# EAGLE design RS485-board (EAGLE 9.6.2)
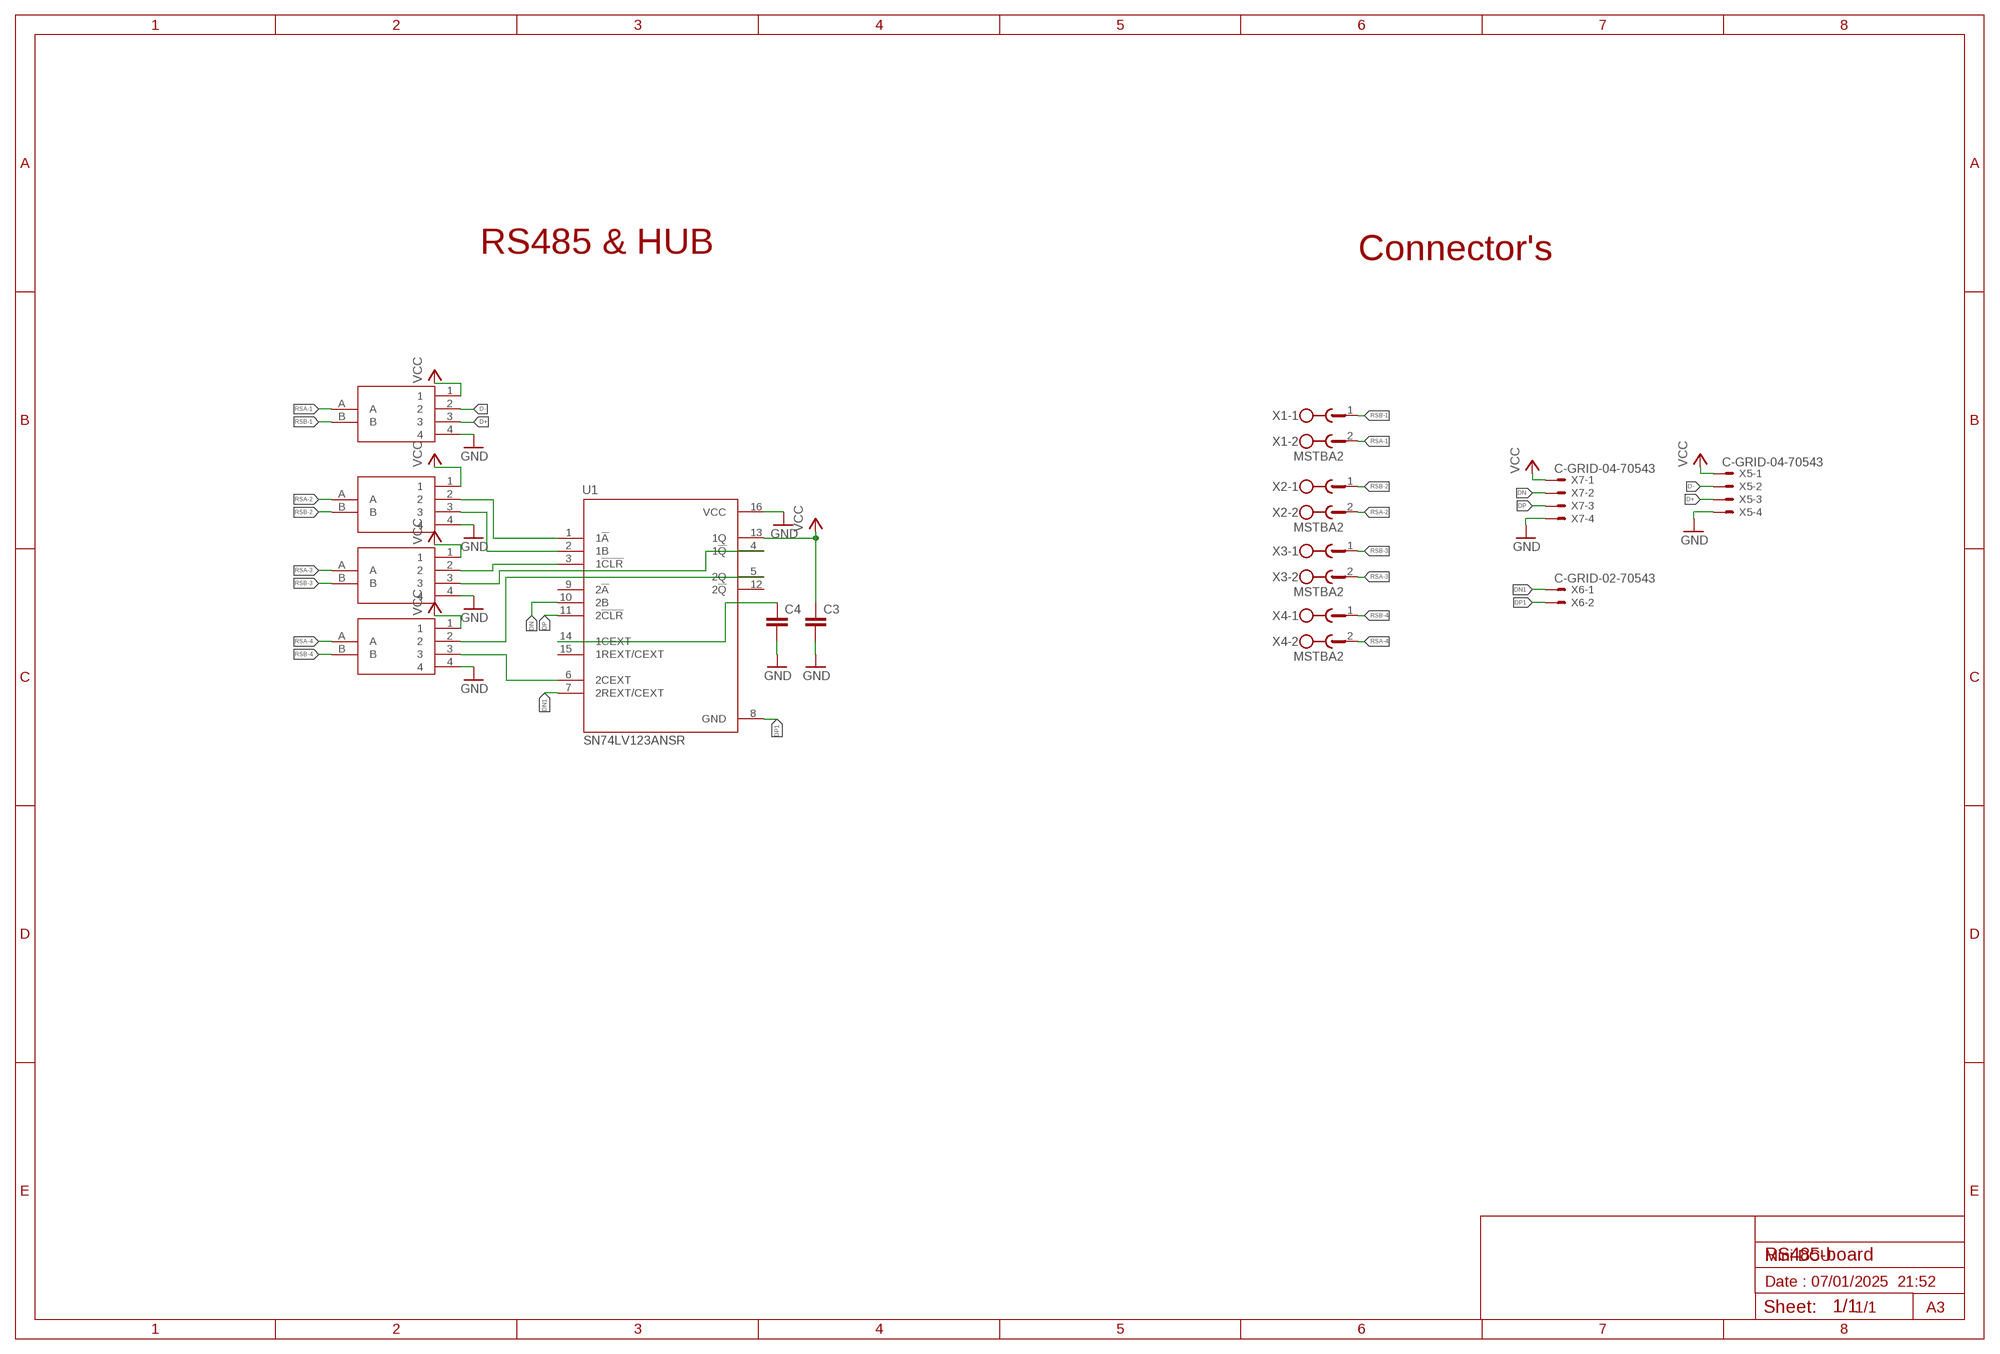
[diagram p0: schematic, sheet 1]

## Parts
C3  C-EUC0603K  [C0603K]
C4  C-EUC0603K  [C0603K]
U1  SN74LV123ANSR  [SOIC127P780X200-16N]
USB2RS1  USB2RS485  [USB2RS485]
USB2RS2  USB2RS485  [USB2RS485]
USB2RS3  USB2RS485  [USB2RS485]
USB2RS5  USB2RS485  [USB2RS485]
X1  MSTBA2  [MSTBA2]
X2  MSTBA2  [MSTBA2]
X3  MSTBA2  [MSTBA2]
X4  MSTBA2  [MSTBA2]
X5  C-GRID-04-70543  [70543-04]
X6  C-GRID-02-70543  [70543-02]
X7  C-GRID-04-70543  [70543-04]

## Nets
D+: USB2RS5.3 X5.3
D-: USB2RS5.2 X5.2
DN: U1.10(2B) X7.2
DN1: U1.7(2REXT/CEXT) X6.1
DP: U1.11(2!CLR) X7.3
DP1: U1.8(GND) X6.2
GND: C3.2 C4.2 U1.16(VCC) USB2RS1.4 USB2RS2.4 USB2RS3.4 USB2RS5.4 X5.4 X7.4
N$21: U1.1(1!A) USB2RS1.2
N$22: U1.2(1B) USB2RS1.3
N$23: U1.3(1!CLR) USB2RS2.2
N$24: U1.4(1!Q) USB2RS2.3
N$25: U1.5(2Q) USB2RS3.2
N$26: U1.6(2CEXT) USB2RS3.3
N$54: C4.1 U1.14(1CEXT)
RSA-1: USB2RS5.A X1.2
RSA-2: USB2RS1.A X2.2
RSA-3: USB2RS2.A X3.2
RSA-4: USB2RS3.A X4.2
RSB-1: USB2RS5.B X1.1
RSB-2: USB2RS1.B X2.1
RSB-3: USB2RS2.B X3.1
RSB-4: USB2RS3.B X4.1
VCC: C3.1 U1.13(1Q) USB2RS1.1 USB2RS2.1 USB2RS3.1 USB2RS5.1 X5.1 X7.1
Unconnected: U1.9(2!A) U1.12(2!Q) U1.15(1REXT/CEXT)

## Notes on the sheet
- RS485 & HUB | Connector's
- Mini DCU
- Date : 07/01/2025  21:52
- 1/1 | A3

## Library data of the parts
C3 C4 = rcl:C-EU: CAPACITOR, European symbol; SPICEPREFIX: C
U1 = SN74LV123ANSR:SN74LV123ANSR: Monostable Multivibrator 13ns 16-SO; CHECK_PRICES: https://www.snapeda.com/parts/SN74LV123ANSR/Texas+Instruments/view-part/?ref=eda; DESCRIPTION: Dual Retriggerable Monostable Multivibrators; DIGIKEY_PART_NUMBER: 296-46201-2-ND; MF: Texas Instruments; MP: SN74LV123ANSR; PACKAGE: SOP-16 Texas Instruments; SNAPEDA_LINK: https://www.snapeda.com/parts/SN74LV123ANSR/Texas+Instruments/view-part/?ref=snap
USB2RS1-USB2RS3 USB2RS5 = USB2RS485:USB2RS485
X1-X4 = con-phoenix-508:MSTBA2: PHOENIX; MF: FARNELL; MPN: 1757242; OC_FARNELL: 3705171; OC_NEWARK: 71C4161
X5 X7 = con-molex:C-GRID-04: CONNECTOR wire to board 2.54 mm (0.100") pitch header; MF: MOLEX; OC_FARNELL: unknown; OC_NEWARK: unknown
X6 = con-molex:C-GRID-02: CONNECTOR wire to board 2.54 mm (0.100") pitch header; MF: MOLEX; OC_FARNELL: unknown; OC_NEWARK: unknown

## Board
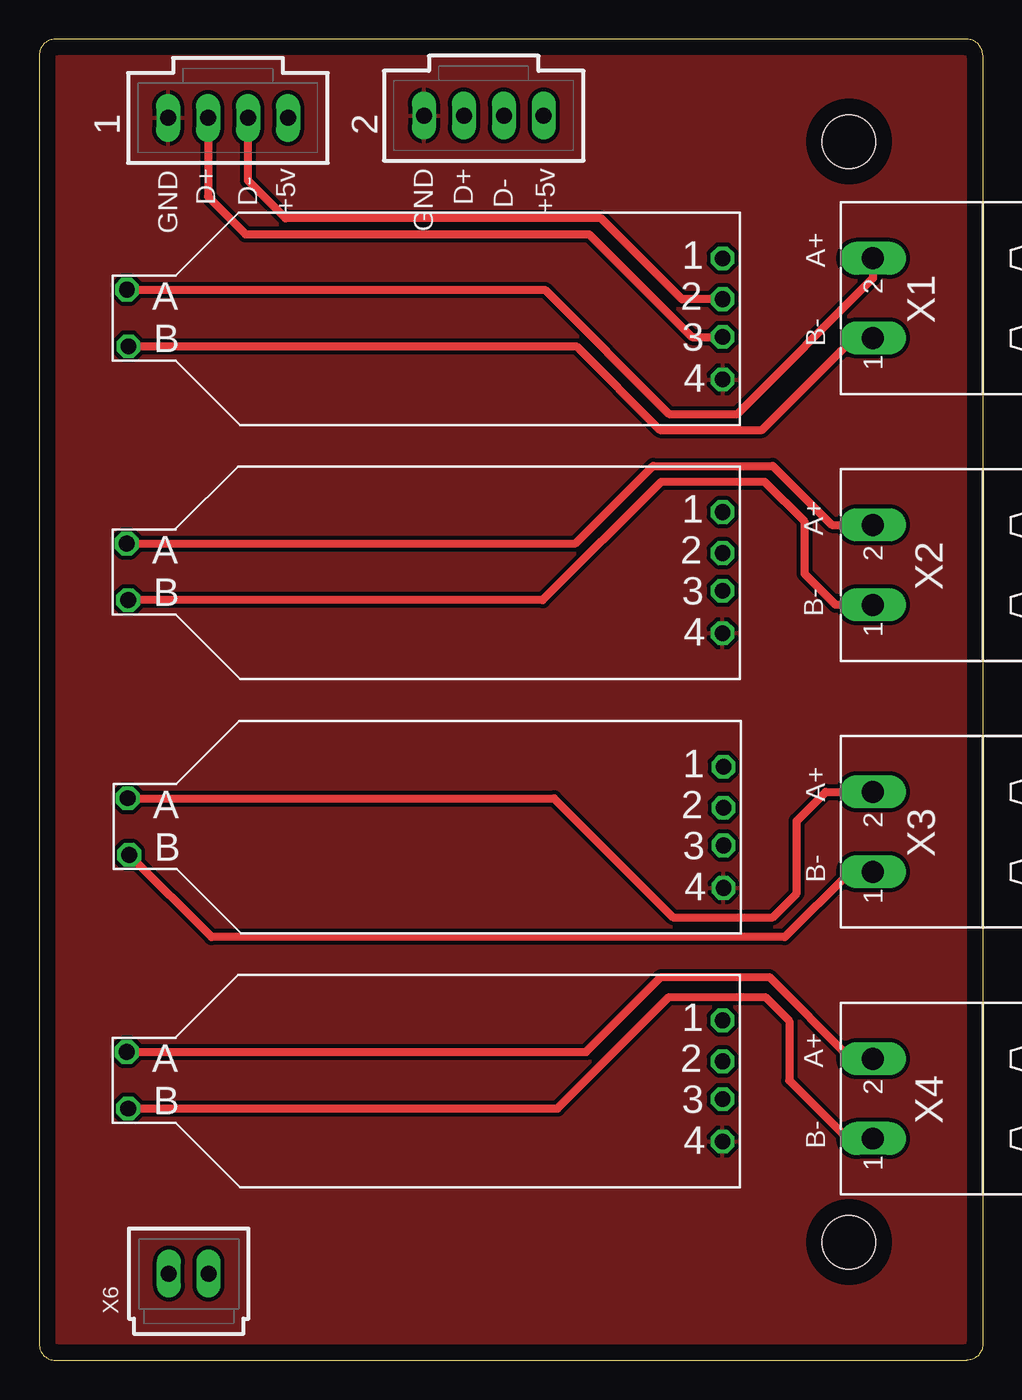
[diagram p1: board, top side]
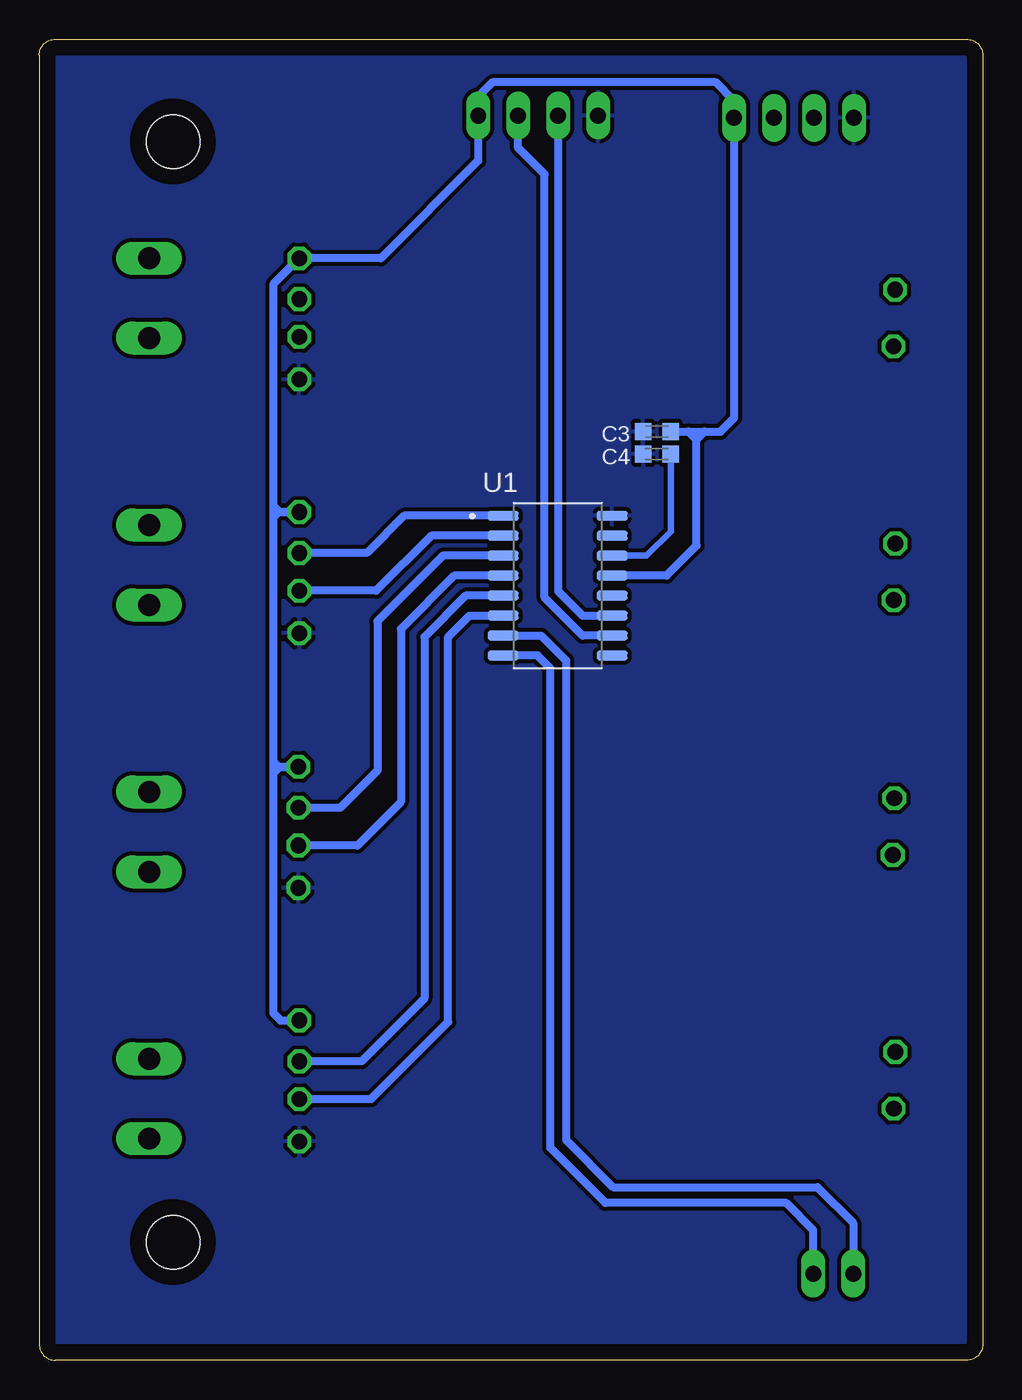
[diagram p2: board, bottom side, seen from below]

Size 60 x 84 mm. Coordinates in mm from the lower left corner, seen from the top.
Outline: 60,83 60,1 arc-90 59,0 1,0 arc-90 0,1 0,83 arc-90 1,84 59,84 arc-90 60,83
Copper layers (1*16): Top 0.035mm / dielectric 1.5mm / Bottom 0.035mm
Design rules "miniDCU *": minimum track width 6mil, minimum drill 0.35mm, track to track 10mil, track to pad 10mil, pad to pad 0.205mm, via to via 0.205mm, smd to smd 6mil, copper to edge 40mil, drill to drill 6mil, minimum pad ring 10mil, minimum via ring 8mil, stop-mask expansion 4mil, vias tented up to drill 0mil, thermal gap 10mil
Holes 3.4 mm at 51.5,7.5 51.5,77.5

### Footprints (pad centres in the part's own frame; a part is rotated, then mirrored left to right if it is on the bottom)
C0603K = smd 1.05 x 1.08: 1 -0.875,0; 2 0.875,0
SOIC127P780X200-16N = smd 1.97 x 0.61: 1 -3.465,4.445; 2 -3.465,3.175; 3 -3.465,1.905; 4 -3.465,0.635; 5 -3.465,-0.635; 6 -3.465,-1.905; 7 -3.465,-3.175; 8 -3.465,-4.445; 9 3.465,-4.445; 10 3.465,-3.175; 11 3.465,-1.905; 12 3.465,-0.635; 13 3.465,0.635; 14 3.465,1.905; 15 3.465,3.175; 16 3.465,4.445
USB2RS485 = drill 1 pad 1.422 octagon: 1 36.9,3.6; 2 36.9,1; 3 36.9,-1.4; 4 36.9,-4.1; A -1,1.6; B -0.9,-2
MSTBA2 = drill 1.397 long: 1 -2.54,5.08; 2 2.54,5.08
70543-04 = drill 1.016 long: 1 -3.81,0; 2 -1.27,0; 3 1.27,0; 4 3.81,0
70543-02 = drill 1.016 long: 1 -1.27,0; 2 1.27,0

### Placement (x,y rotation side)
C3  20.73,59.05 180 bottom
C4  20.72,57.61 180 bottom
U1  27.03,49.26 0 bottom
USB2RS1  6.56,50.33 0 top
USB2RS2  6.62,34.13 0 top
USB2RS3  6.56,18 0 top
USB2RS5  6.57,66.47 0 top
X1  58.11,67.54 90 top
X2  58.11,50.57 90 top
X3  58.11,33.6 90 top
X4  58.11,16.63 90 top
X5  12,79 180 top
X6  9.5,5.5 0 top
X7  28.27,79.14 180 top

### Tracks (layer width: path | path; a pad name or v marks a point on that pad's centre or on a via)
D+
  Top 0.508: X5.3 10.73,74 13.12,71.61 34.97,71.61 41.5,65.07 USB2RS5.3
D-
  Top 0.508: USB2RS5.2 40.88,67.47 35.73,72.62 15.66,72.62 13.27,75.01 X5.2
DN
  Bottom 0.508: U1.10 25.45,46.08 27.85,48.49 27.85,75.42 29.54,77.1 X7.2
DN1
  Bottom 0.508: U1.7 28.08,46.08 26.5,44.5 26.5,14 23.5,11 10.5,11 8.23,8.73 X6.1
DP
  Bottom 0.508: X7.3 27,48.91 25.45,47.35 U1.11
DP1
  Bottom 0.508: X6.2 10.77,8.27 12.5,10 24,10 27.5,13.5 27.5,44 28.31,44.81 U1.8
GND
  pour Bottom: 0,83 arc-90 1,84 59,84 arc-90 60,83 60,1 arc-90 59,0 1,0 arc-90 0,1
  pour Top: 0,83 arc-90 1,84 59,84 arc-90 60,83 60,1 arc-90 59,0 1,0 arc-90 0,1
N$21
  Bottom 0.508: U1.1 36.8,53.7 39.17,51.33 USB2RS1.2
N$22
  Bottom 0.508: U1.2 35.07,52.43 38.57,48.93 USB2RS1.3
N$23
  Bottom 0.508: U1.3 34.34,51.16 38.5,47 38.5,37.5 40.87,35.13 USB2RS2.2
N$24
  Bottom 0.508: U1.4 33.61,49.89 37,46.5 37,35.5 39.77,32.73 USB2RS2.3
N$25
  Bottom 0.508: U1.5 32.88,48.62 35.5,46 35.5,23 39.5,19 USB2RS3.2
N$26
  Bottom 0.508: USB2RS3.3 38.9,16.6 34,21.5 34,46 32.65,47.35 U1.6
N$54
  Bottom 0.406: U1.14 21.37,51.16 19.84,52.7 C4.1
RSA-1
  Top 0.508: USB2RS5.A 32.15,68.07 40.05,60.18 44.4,60.18 53.03,68.81 X1.2
RSA-2
  Top 0.508: USB2RS1.A 34.09,51.93 39.03,56.87 46.65,56.87 50.41,53.11 X2.2
RSA-3
  Top 0.508: USB2RS2.A 32.74,35.73 40.3,28.17 46.65,28.17 48.17,29.7 48.17,34.29 50.02,36.14 X3.2
RSA-4
  Top 0.508: USB2RS3.A 34.78,19.6 39.54,24.36 46.43,24.36 51.62,19.17 X4.2
RSB-1
  Top 0.508: USB2RS5.B 34.16,64.47 39.48,59.16 45.97,59.16 51.81,65 X1.1
RSB-2
  Top 0.508: X2.1 50.65,48.03 48.68,50 48.68,53.32 46.14,55.86 39.54,55.86 32.01,48.33 USB2RS1.B
RSB-3
  Top 0.508: USB2RS2.B 10.95,26.9 47.41,26.9 51.57,31.06 X3.1
RSB-4
  Top 0.508: USB2RS3.B 32.96,16 40.05,23.09 46.17,23.09 47.69,21.57 47.69,17.78 51.38,14.09 X4.1
VCC
  Bottom 0.508: U1.13 20.1,49.89 18.2,51.79 18.2,58.55 | 45.13,54.33 45.13,68.42 USB2RS5.1 38.28,70.07 32.08,76.27 X7.1 32.08,80.36 31.19,81.26 16.96,81.26 15.81,80.1 X5.1 15.81,59.91 16.68,59.04 16.69,59.05 17.69,59.05 | 45.13,54.33 44.73,53.93 USB2RS1.1 44.76,53.93 45.13,53.57 | 45.13,53.57 45.13,38.08 | 45.13,38.08 44.78,37.73 USB2RS2.1 44.71,37.73 45.13,37.32 | 45.13,37.32 45.13,22.08 44.65,21.6 USB2RS3.1 | 45.13,54.33 45.13,53.57 | 45.13,38.08 45.13,37.32 | C3.1 18.71,59.05 | 18.71,59.05 17.69,59.05 | 17.69,59.05 18.2,58.55 | 18.2,58.55 18.71,59.05

### Text on the board
tPlace: A+ | B- | A+ | B- | A+ | B- | A+ | B-
tNames: 1 | 2 | GND | D+ | +5v | GND | D+ | +5v | D- | D-